# Altium schematic sheet 1166V30-3.SchDoc: Half-Bridge Phase 2
size A3; Author: M. Kutzsche; Organization: Kübrich Ing.-Gesellschaft; Address1: mbH & Co. KG; Address2: Weißmühle 10; Address3: D-96170 Priesendorf; DocumentNumber: UltraZohm; Revision: 30; SheetNumber: 3; SheetTotal: 5
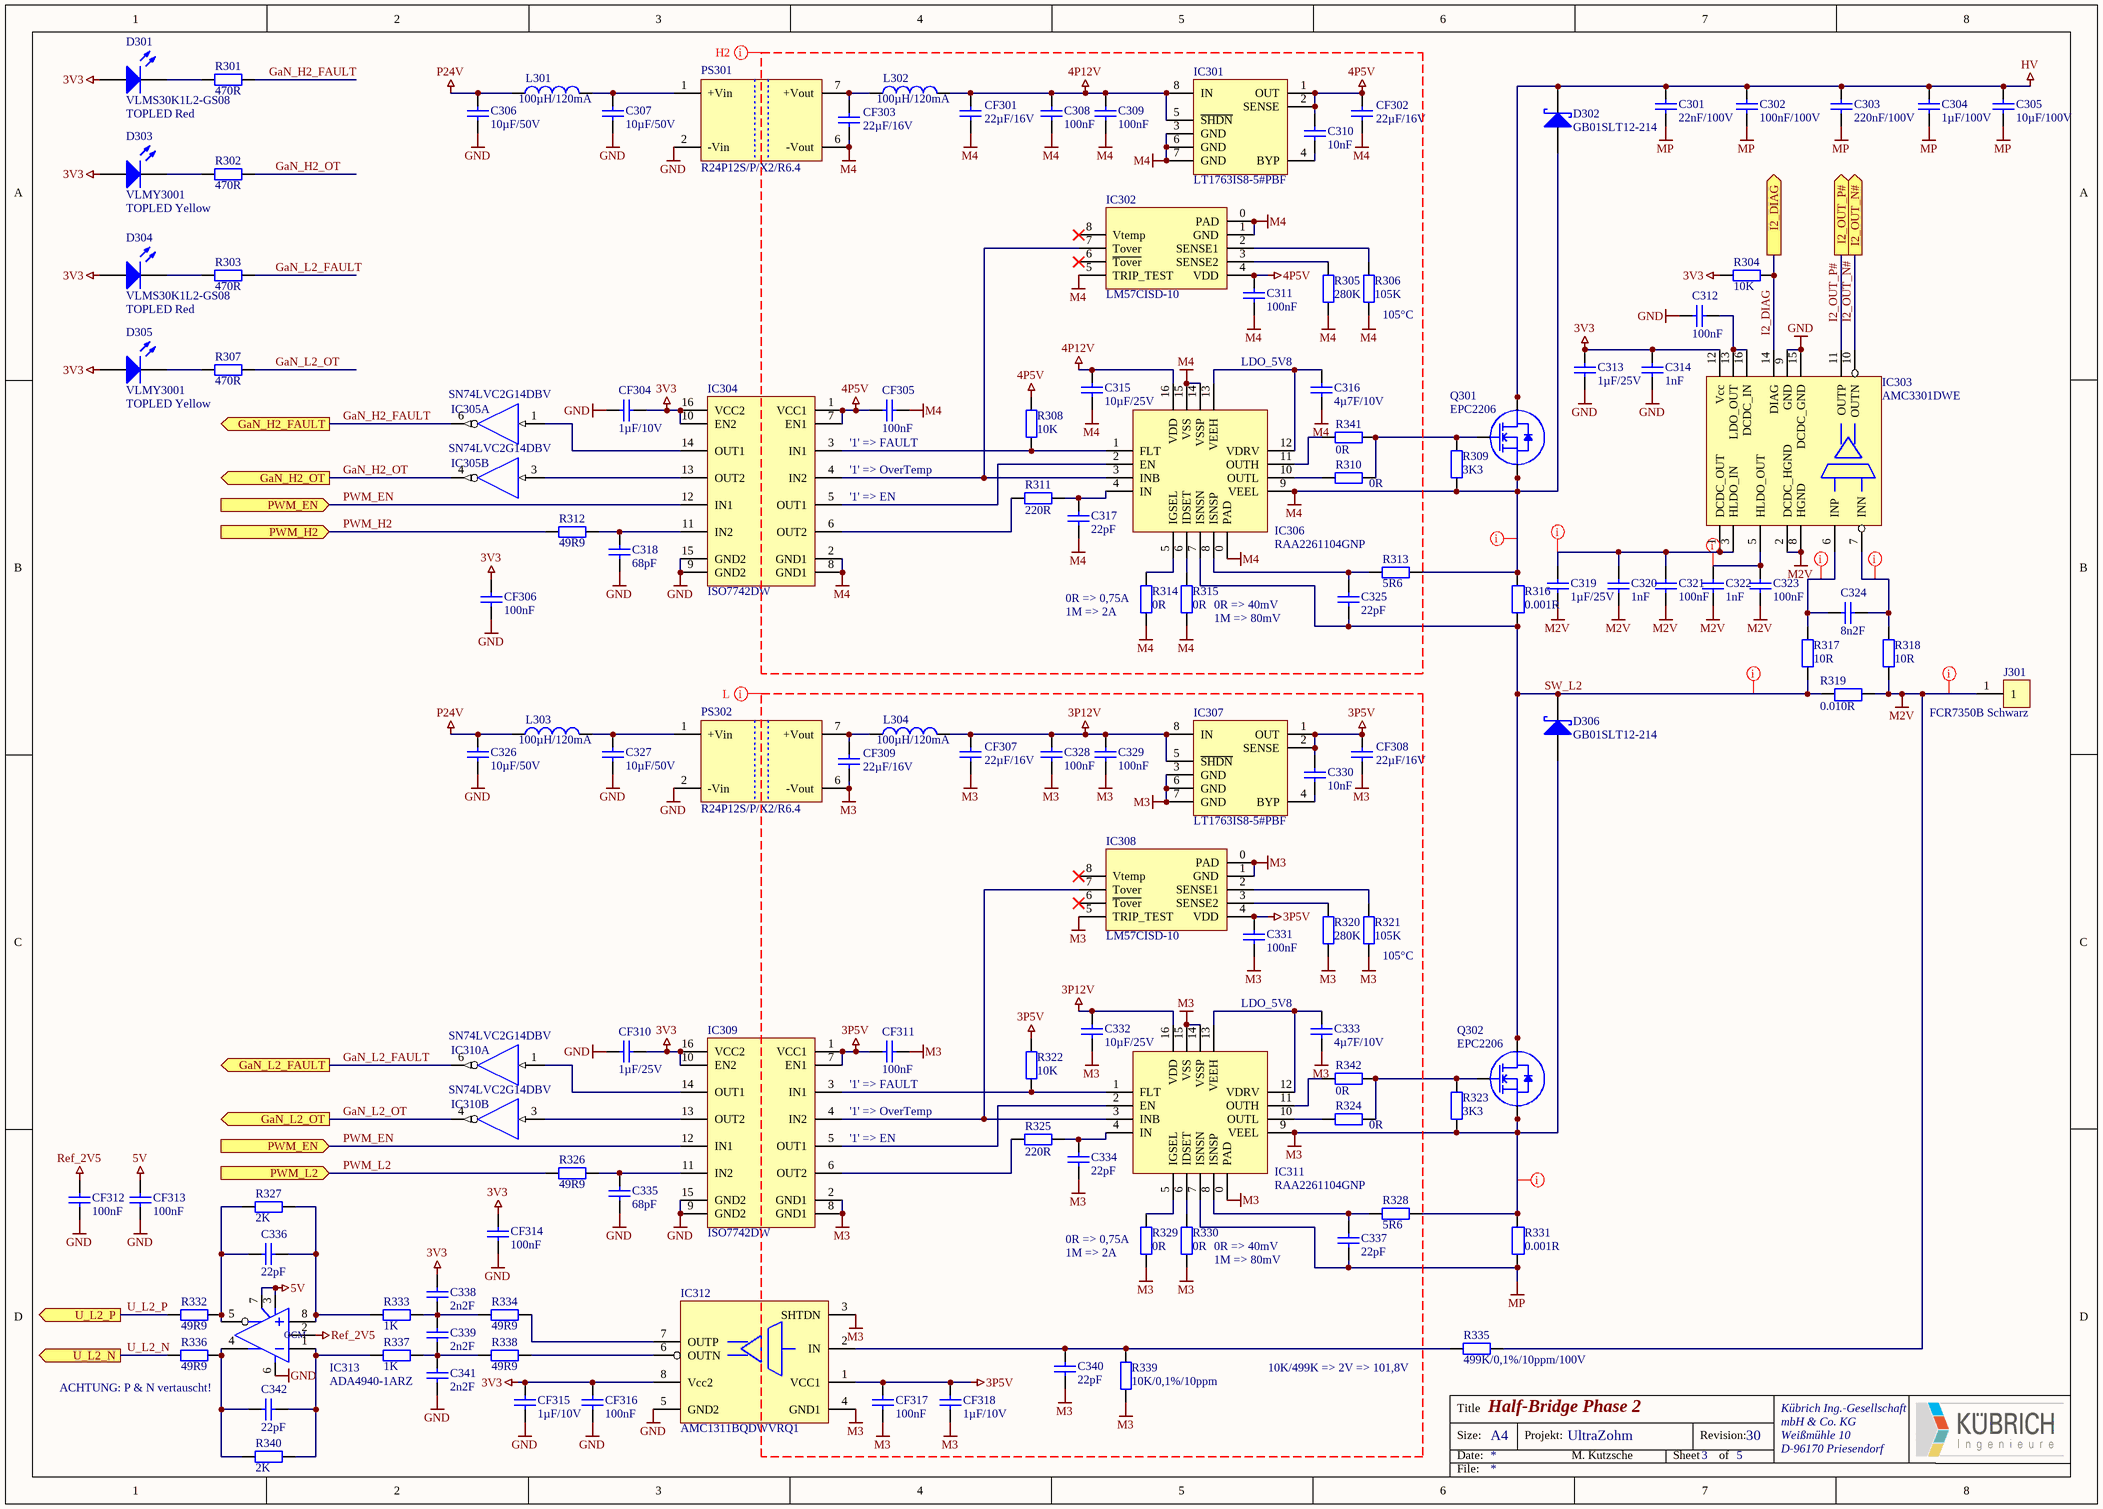
[diagram p0: 1166V30-3.SchDoc]

## Parts
C301  22nF/100V  [0805-Cap]
C302  100nF/100V  [0805-Cap]
C303  220nF/100V  [0805-Cap]
C304  1µF/100V  [0805-Cap]
C305  10µF/100V  [1210-Cap]
C306  10µF/50V  [1206-Cap]
C307  10µF/50V  [1206-Cap]
C308  100nF  [0603-Cap]
C309  100nF  [0603-Cap]
C310  10nF  [0603-Cap]
C311  100nF  [0603-Cap]
C312  100nF  [0603-Cap]
C313  1µF/25V  [1206-Cap]
C314  1nF  [1206-Cap]
C315  10µF/25V  [0805-Cap]
C316  4µ7F/10V  [0805-Cap]
C317  22pF  [0603-Cap]
C318  68pF  [0603-Cap]
C319  1µF/25V  [0603-Cap]
C320  1nF  [0603-Cap]
C321  100nF  [0603-Cap]
C322  1nF  [1206-Cap]
C323  100nF  [1206-Cap]
C324  8n2F  [0603-Cap]
C325  22pF  [0603-Cap]
C326  10µF/50V  [1206-Cap]
C327  10µF/50V  [1206-Cap]
C328  100nF  [0603-Cap]
C329  100nF  [0603-Cap]
C330  10nF  [0603-Cap]
C331  100nF  [0603-Cap]
C332  10µF/25V  [0805-Cap]
C333  4µ7F/10V  [0805-Cap]
C334  22pF  [0603-Cap]
C335  68pF  [0603-Cap]
C336  22pF  [0603-Cap]
C337  22pF  [0603-Cap]
C338  2n2F  [0603-Cap]
C339  2n2F  [0603-Cap]
C340  22pF  [0603-Cap]
C341  2n2F  [0603-Cap]
C342  22pF  [0603-Cap]
CF301  22µF/16V  [0805-Cap]
CF302  22µF/16V  [0805-Cap]
CF303  22µF/16V  [0805-Cap]
CF304  1µF/10V  [0603-Cap]
CF305  100nF  [0603-Cap]
CF306  100nF  [0603-Cap]
CF307  22µF/16V  [0805-Cap]
CF308  22µF/16V  [0805-Cap]
CF309  22µF/16V  [0805-Cap]
CF310  1µF/25V  [0603-Cap]
CF311  100nF  [0603-Cap]
CF312  100nF  [0603-Cap]
CF313  100nF  [0603-Cap]
CF314  100nF  [0603-Cap]
CF315  1µF/10V  [0603-Cap]
CF316  100nF  [0603-Cap]
CF317  100nF  [0603-Cap]
CF318  1µF/10V  [0603-Cap]
D301  VLMS30K1L2-GS08  Class II: TOPLED Red  [PLCC-2_rot]
D302  GB01SLT12-214  [DO-214 (SMB)]
D303  VLMY3001  Class II: TOPLED Yellow  [PLCC-2_gelb]
D304  VLMS30K1L2-GS08  Class II: TOPLED Red  [PLCC-2_rot]
D305  VLMY3001  Class II: TOPLED Yellow  [PLCC-2_gelb]
D306  GB01SLT12-214  [DO-214 (SMB)]
IC301  LT1763IS8-5#PBF  [SOIC-8-N]
IC302  LM57CISD-10  [WSON-8 (2.5x2.5mm)]
IC303  AMC3301DWE  [SOIC-16-W - 8.1mm]
IC304  ISO7742DW  [SOIC-16-W - 8.1mm]
IC305  SN74LVC2G14DBV  [SOT-23-6]  (parts A,B of 2)
IC306  RAA2261104GNP  [QFN-16 (4x4mm)]
IC307  LT1763IS8-5#PBF  [SOIC-8-N]
IC308  LM57CISD-10  [WSON-8 (2.5x2.5mm)]
IC309  ISO7742DW  [SOIC-16-W - 8.1mm]
IC310  SN74LVC2G14DBV  [SOT-23-6]  (parts A,B of 2)
IC311  RAA2261104GNP  [QFN-16 (4x4mm)]
IC312  AMC1311BQDWVRQ1  [SOIC-8-W]
IC313  ADA4940-1ARZ  [SOIC-8-N]
J301  FCR7350B Schwarz  [SLB4-I/90 - 4mm - Schwarz - CLIFF]
L301  100µH/120mA  [1007-IND (2518)]
L302  100µH/120mA  [1007-IND (2518)]
L303  100µH/120mA  [1007-IND (2518)]
L304  100µH/120mA  [1007-IND (2518)]
PS301  R24P12S/P/X2/R6.4  [SIP-7 Single - X2]
PS302  R24P12S/P/X2/R6.4  [SIP-7 Single - X2]
Q301  EPC2206  [D0232]
Q302  EPC2206  [D0232]
R301  470R  [0603-Res]
R302  470R  [0603-Res]
R303  470R  [0603-Res]
R304  10K  [0603-Res]
R305  280K  [0603-Res]
R306  105K  [0603-Res]
R307  470R  [0603-Res]
R308  10K  [0603-Res]
R309  3K3  [0603-Res]
R310  0R  [0603-Res]
R311  220R  [0603-Res]
R312  49R9  [0603-Res]
R313  5R6  [0603-Res]
R314  0R  [0603-Res]
R315  0R  [0603-Res]
R316  0.001R  [2512]
R317  10R  [0603-Res]
R318  10R  [0603-Res]
R319  0.010R  [GMR320]
R320  280K  [0603-Res]
R321  105K  [0603-Res]
R322  10K  [0603-Res]
R323  3K3  [0603-Res]
R324  0R  [0603-Res]
R325  220R  [0603-Res]
R326  49R9  [0603-Res]
R327  2K  [0603-Res]
R328  5R6  [0603-Res]
R329  0R  [0603-Res]
R330  0R  [0603-Res]
R331  0.001R  [2512]
R332  49R9  [0603-Res]
R333  1K  [0603-Res]
R334  49R9  [0603-Res]
R335  499K/0,1%/10ppm/100V  [0805-Res]
R336  49R9  [0603-Res]
R337  1K  [0603-Res]
R338  49R9  [0603-Res]
R339  10K/0,1%/10ppm  [0603-Res]
R340  2K  [0603-Res]
R341  0R  [0603-Res]
R342  0R  [0603-Res]

## Ports
GaN_H2_FAULT (out), GaN_H2_OT (out), GaN_L2_FAULT (out), GaN_L2_OT (out), I2_DIAG (out), I2_OUT_N# (out), I2_OUT_P# (out), PWM_EN (in), PWM_H2 (in), PWM_L2 (in), U_L2_N (out), U_L2_P (out)

## Nets
3P5V: C330.1 C331.1 CF308.1 CF311.2 CF317.1 CF318.1 IC307.1(OUT) IC307.2(SENSE) IC308.4(VDD) IC309.1(VCC1) IC309.7(EN1) IC312.1(VCC1) R322.1
3P12V: C328.1 C329.1 C332.2 CF307.1 IC307.5(~{SHDN}) IC307.8(IN) IC311.16(VDD) L304.2
3V3: C313.1 C314.1 C338.2 CF304.1 CF306.1 CF310.1 CF314.1 CF315.1 CF316.1 D301.1(A) D303.1(A) D304.1(A) D305.1(A) IC303.12(Vcc) IC304.10(EN2) IC304.16(VCC2) IC309.10(EN2) IC309.16(VCC2) IC312.8(Vcc2) R304.2
4P5V: C310.1 C311.1 CF302.1 CF305.2 IC301.1(OUT) IC301.2(SENSE) IC302.4(VDD) IC304.1(VCC1) IC304.7(EN1) R308.1
4P12V: C308.1 C309.1 C315.2 CF301.1 IC301.5(~{SHDN}) IC301.8(IN) IC306.16(VDD) L302.2
5V: CF313.1 IC313.3(V+) IC313.7(EN)
GND: C306.1 C307.1 C312.1 C313.2 C314.2 C318.1 C326.1 C327.1 C335.1 C341.1 CF304.2 CF306.2 CF310.2 CF312.2 CF313.2 CF314.2 CF315.2 CF316.2 IC303.9(GND) IC303.15(DCDC_GND) IC304.9(GND2) IC304.15(GND2) IC305.2(GND) IC309.9(GND2) IC309.15(GND2) IC310.2(GND) IC312.5(GND2) IC313.6(V-) PS301.2(-Vin) PS302.2(-Vin)
HV: C301.1 C302.1 C303.1 C304.1 C305.1 D302.2(K) Q301.3(D1) Q301.4(D2) Q301.7(D3) Q301.8(D4) Q301.11(D5) Q301.12(D6) Q301.15(D7) Q301.16(D8) Q301.19(D9) Q301.20(D10) Q301.23(D11) Q301.24(D12) Q301.27(D13) Q301.28(D14)
M2V: C319.2 C320.2 C321.2 C322.2 C323.2 IC303.2(DCDC_HGND) IC303.8(HGND) J301.1 R318.1 R319.1 R335.2
M3: C328.2 C329.2 C331.2 C332.1 C333.2 C334.1 C340.1 CF307.2 CF308.2 CF309.2 CF311.1 CF317.2 CF318.2 D306.1(A) IC307.3(GND) IC307.6(GND) IC307.7(GND) IC308.0(PAD) IC308.1(GND) IC308.5(TRIP_TEST) IC309.2(GND1) IC309.8(GND1) IC311.0(PAD) IC311.9(VEEL) IC311.14(VSSP) IC311.15(VSS) IC312.3(SHTDN) IC312.4(GND1) PS302.6(-Vout) Q302.2(S1) Q302.5(S2) Q302.6(S3) Q302.9(S4) Q302.10(S5) Q302.13(S6) Q302.14(S7) Q302.17(S8) Q302.18(S9) Q302.21(S10) Q302.22(S11) Q302.25(S12) Q302.26(S13) Q302.29(S14) Q302.30(Sub) R320.2 R321.2 R323.1 R328.2 R329.2 R330.2 R331.2 R339.2
M4: C308.2 C309.2 C311.2 C315.1 C316.2 C317.1 CF301.2 CF302.2 CF303.2 CF305.1 D302.1(A) IC301.3(GND) IC301.6(GND) IC301.7(GND) IC302.0(PAD) IC302.1(GND) IC302.5(TRIP_TEST) IC304.2(GND1) IC304.8(GND1) IC306.0(PAD) IC306.9(VEEL) IC306.14(VSSP) IC306.15(VSS) PS301.6(-Vout) Q301.2(S1) Q301.5(S2) Q301.6(S3) Q301.9(S4) Q301.10(S5) Q301.13(S6) Q301.14(S7) Q301.17(S8) Q301.18(S9) Q301.21(S10) Q301.22(S11) Q301.25(S12) Q301.26(S13) Q301.29(S14) Q301.30(Sub) R305.2 R306.2 R309.1 R313.2 R314.2 R315.2 R316.2
MP: C301.2 C302.2 C303.2 C304.2 C305.2 C337.1 IC311.7(ISNSN) R331.1
P24V: C306.2 C326.2 L301.1 L303.1
Ref_2V5: CF312.1 IC313.2(OCM)
VCC: IC305.5(VCC) IC310.5(VCC)
GaN_H2_FAULT: IC305.6(1Y) R301.2 ; port GaN_H2_FAULT
GaN_H2_OT: IC305.4(2Y) R302.2 ; port GaN_H2_OT
GaN_L2_FAULT: IC310.6(1Y) R303.2 ; port GaN_L2_FAULT
GaN_L2_OT: IC310.4(2Y) R307.2 ; port GaN_L2_OT
I2_DIAG: IC303.14(DIAG) R304.1 ; port I2_DIAG
I2_OUT_N#: IC303.10(OUTN) ; port I2_OUT_N#
I2_OUT_P#: IC303.11(OUTP) ; port I2_OUT_P#
PWM_EN: IC304.12(IN1) IC309.12(IN1) ; port PWM_EN
PWM_H2: R312.2 ; port PWM_H2
PWM_L2: R326.2 ; port PWM_L2
SW_L2: C325.1 D306.2(K) IC306.7(ISNSN) Q302.3(D1) Q302.4(D2) Q302.7(D3) Q302.8(D4) Q302.11(D5) Q302.12(D6) Q302.15(D7) Q302.16(D8) Q302.19(D9) Q302.20(D10) Q302.23(D11) Q302.24(D12) Q302.27(D13) Q302.28(D14) R316.1 R317.1 R319.2
U_L2_N: R336.2 ; port U_L2_N
U_L2_P: R332.2 ; port U_L2_P
NetC307_2: C307.2 L301.2 PS301.1(+Vin)
NetC310_2: C310.2 IC301.4(BYP)
NetC312_2: C312.2 IC303.13(LDO_OUT) IC303.16(DCDC_IN)
NetC316_1: C316.1 IC306.12(VDRV) IC306.13(VEEH)
NetC317_2: C317.2 IC306.4(IN) R311.1
NetC318_2: C318.2 IC304.11(IN2) R312.1
NetC319_1: C319.1 C320.1 C321.1 IC303.1(DCDC_OUT) IC303.3(HLDO_IN)
NetC322_1: C322.1 C323.1 IC303.5(HLDO_OUT)
NetC324_1: C324.1 IC303.7(INN) R318.2
NetC324_2: C324.2 IC303.6(INP) R317.2
NetC325_2: C325.2 IC306.8(ISNSP) R313.1
NetC327_2: C327.2 L303.2 PS302.1(+Vin)
NetC330_2: C330.2 IC307.4(BYP)
NetC333_1: C333.1 IC311.12(VDRV) IC311.13(VEEH)
NetC334_2: C334.2 IC311.4(IN) R325.1
NetC335_2: C335.2 IC309.11(IN2) R326.1
NetC336_1: C336.1 IC313.8(+) R327.1 R333.2
NetC336_2: C336.2 IC313.5(Out) R327.2 R332.1
NetC337_2: C337.2 IC311.8(ISNSP) R328.1
NetC338_1: C338.1 C339.2 R333.1 R334.2
NetC339_1: C339.1 C341.2 R337.1 R338.2
NetC340_2: C340.2 IC312.2(IN) R335.1 R339.1
NetC342_1: C342.1 IC313.1(-) R337.2 R340.1
NetC342_2: C342.2 IC313.4(Out) R336.1 R340.2
NetCF303_1: CF303.1 L302.1 PS301.7(+Vout)
NetCF309_1: CF309.1 L304.1 PS302.7(+Vout)
NetD301_2: D301.2(K) R301.1
NetD303_2: D303.2(K) R302.1
NetD304_2: D304.2(K) R303.1
NetD305_2: D305.2(K) R307.1
NetIC302_2: IC302.2(SENSE1) R306.1
NetIC302_3: IC302.3(SENSE2) R305.1
NetIC302_7: IC302.7(Tover) IC304.4(IN2) IC306.3(INB)
NetIC304_3: IC304.3(IN1) IC306.1(FLT) R308.2
NetIC304_5: IC304.5(OUT1) IC306.2(EN)
NetIC304_6: IC304.6(OUT2) R311.2
NetIC304_13: IC304.13(OUT2) IC305.3(2A)
NetIC304_14: IC304.14(OUT1) IC305.1(1A)
NetIC306_5: IC306.5(IGSEL) R314.1
NetIC306_6: IC306.6(IDSET) R315.1
NetIC306_10: IC306.10(OUTL) R310.1
NetIC306_11: IC306.11(OUTH) R341.1
NetIC308_2: IC308.2(SENSE1) R321.1
NetIC308_3: IC308.3(SENSE2) R320.1
NetIC308_7: IC308.7(Tover) IC309.4(IN2) IC311.3(INB)
NetIC309_3: IC309.3(IN1) IC311.1(FLT) R322.2
NetIC309_5: IC309.5(OUT1) IC311.2(EN)
NetIC309_6: IC309.6(OUT2) R325.2
NetIC309_13: IC309.13(OUT2) IC310.3(2A)
NetIC309_14: IC309.14(OUT1) IC310.1(1A)
NetIC311_5: IC311.5(IGSEL) R329.1
NetIC311_6: IC311.6(IDSET) R330.1
NetIC311_10: IC311.10(OUTL) R324.1
NetIC311_11: IC311.11(OUTH) R342.1
NetIC312_6: IC312.6(OUTN) R338.1
NetIC312_7: IC312.7(OUTP) R334.1
NetQ301_1: Q301.1(G) R309.2 R310.2 R341.2
NetQ302_1: Q302.1(G) R323.2 R324.2 R342.2

Not connected (* = marked no-connect by the designer): IC302 6(~{Tover})* 8(Vtemp)*; IC308 6(~{Tover})* 8(Vtemp)*

## Layout directives
net class H2: 4P5V, 4P12V, M2V, M4, NetC319_1, NetC322_1, NetC324_1, NetC324_2, SW_L2
net class L: 3P5V, 3P12V, M3

## Notes on the sheet
- (near R306) 105°C
- LDO_5V8
- '1' => FAULT
- '1' => OverTemp
- (near IC304) '1' => EN
- (near R314) 1M => 2A
- (near R314) 0R => 0,75A
- (near R315) 0R => 40mV
- (near R315) 1M => 80mV
- (near R321) 105°C
- (near IC309) '1' => EN
- (near R329) 1M => 2A
- (near R329) 0R => 0,75A
- (near R330) 0R => 40mV
- (near R330) 1M => 80mV
- ACHTUNG: P & N vertauscht!
- (near R335) 10K/499K => 2V => 101,8V
- Title
- Size:
- Date:
- A4
- Projekt:
- Sheet
- Revision:
- of
- File:

## Library data of the parts
C301-C342 CF301-CF318 = Cap_SMD: Capacitor (SMD); Class I: Pasiv; Class II: Capacitor; Last edited: 20.11.2006 10:25
  C301: value: 22nF/100V
  C302: value: 100nF/100V
  C303: value: 220nF/100V
  C304: value: 1µF/100V
  C305: value: 10µF/100V
  C306 C307 C326 C327: value: 10µF/50V
  C308 C309 C311 C312 C321 C323 C328 C329 C331 CF305 CF306 CF311-CF314 CF316 CF317: value: 100nF
  C310 C330: value: 10nF
  C313 C319 CF310: value: 1µF/25V
  C314 C320 C322: value: 1nF
  C315 C332: value: 10µF/25V
  C316 C333: value: 4µ7F/10V
  C317 C325 C334 C336 C337 C340 C342: value: 22pF
  C318 C335: value: 68pF
  C324: value: 8n2F
  C338 C339 C341: value: 2n2F
  CF301-CF303 CF307-CF309: value: 22µF/16V
  CF304 CF315 CF318: value: 1µF/10V
D301 D304 = VLMS30K1L2-GS08: Top LED Super red, 2mA, 18mcd, -40-100°C; Manufacturer: Vishay; Class I: Discrete; Best.-Nr.: Farnell 132-8349; Last edited: 23.01.2007 08:58
D302 D306 = GB01SLT12-214: Silicon Carbide Schottky Diode Vr=1200V If=1A; Manufacturer: GeneSiC Semiconductor; Class I: Discret; Package information: Unknown; Best.-Nr.: DigiKey: 1242-1169-1-ND; Class II: Silicon Carbide Schottky Diode Vr=1200V If=1A; Datasheet: Ver. 7 Nov 2000; Package reference: DO-214AA (SMB)
D303 D305 = VLMY3001: Top LED Yellow, 2mA, 18mcd, -40-100°C; Manufacturer: Vishay; Class I: Discrete; Best.-Nr.: ???; Last edited: 23.01.2007 08:58
IC301 IC307 = LT1763IS8-5#PBF: LDO 5V/500mA, Vin 20V (-40-125°C); Manufacturer: Linear Technology; Class I: Discret; Package information: Unknown; Best.-Nr.: Farnell 229-5214; Class II: LDO 5V/500mA, Vin 20V (-40-125°C); Datasheet: ???; Package reference: SO-8
IC302 IC308 = LM57CISD-10: Temperature Sensor/Switch -40 - 150°C, Resistor-Programmable, 10°C Hysterese; Manufacturer: Texas Instruments; Class I: Sensor; Best.-Nr.: DigiKey: LM57CISD-10/NOPBCT-ND; Class II: Temperature Sensor/Switch -40 - 150°C, Resistor-Programmable, 10°C Hysterese
IC303 = AMC3301DWE: ±250 mV Input Voltage Range, Reinforced Isolated Amplifier and High Bandwidth of 300 kHz; Manufacturer: Texas Instruments; Class II: ±250 mV, 300KHz, -40-125°C; Package information: Unknown; Best.-Nr.: DigiKey: 296-AMC3301DWE-ND; Class I: Isolated Amplifier; Datasheet: Unknown; Package reference: SOIC-16-W
IC304 IC309 = ISO7742DW: Quad-CH 100Mbps Isolators 2 IN/2 OUT, 5000V Reinforced, (-40-125°C); Manufacturer: Texas Instruments; Class I: Optocoupler; Package information: Unknown; Best.-Nr.: DigiKey: 296-44609-1-ND; Class II: Quad-CH 100Mbps Isolators 2 IN/2 OUT, 5000V Reinforced, (-40-125°C); Datasheet: Unknown; Package reference: SOIC-16W
IC305 IC310 = SN74LVC2G14D_: Dual Inverter with Schmitt Trigger Input; Manufacturer: Texas Instrument; Class I: Logic; value121: SN74LVC2G14DCK; Datasheet: SCES200J; Class II: Dual Inverter with Schmitt Trigger Input; value111: SN74LVC2G14DBV; Last edited: 22.01.2007 11:08
IC306 IC311 = RAA2261104GNP: Low -Side GaN FET-Driver, 6,5V - 18V; Manufacturer: Renesas; Class I: Discret; Package information: Unknown; Best.-Nr.: Mouser: 968-2261104GNP#AA0; Class II: Low -Side GaN FET-Driver, 6,5V - 18V; Datasheet: Rev. Mar 2002; Package reference: QFN-16
IC312 = AMC1311BQDWVRQ1: 2V Input, Automotive High-Impedance, Reinforced Isolated Amplifier for Voltage Sensing; Manufacturer: Texas Instruments; Class II: 2V, 275KHz, -40-125°C; Package information: Unknown; Best.-Nr.: Mouser: 595-AMC1311BQDWVRQ1; Class I: Isolated Amplifier; Datasheet: Unknown; Package reference: SOIC-8-W
IC313 = ADA4940-1ARZ: Fully Differential ADC Drivers (-40-125°C); Manufacturer: ANALOG DEVICES; Class I: Analog; Best.-Nr.: Farnell 209-6178; Class II: Fully Differential ADC Drivers (-40-125°C); Datasheet: DSO11449, Ver. Aug 2000; Last edited: 04.01.2007 10:14; Package Reference: SOIC-N-8
J301 = FCR7350B Schwarz: Labor Winkelbuchsen 4mm Schwarz; Manufacturer: CLIFF Electronic; Class I: Connectors; Best.-Nr.: Farnell: 185-4507; Class II: Labor Winkelbuchsen 4mm Schwarz; Last edited: 07.03.2007 13:28
L301-L304 = CB2518T101K: 100µH, 60/120mA. (1007), -40-105°C; Manufacturer: Taiyo Yuden; Class I: Pasive; Best.-Nr.: DigiKey:   587-2192-1-ND; Class II: 100µH, 60/120mA. (1007), -40-105°C; Last edited: 08.12.2006 12:28
PS301 PS302 = R24P12S/P/X2/R6.4: DC/DC Converter 24V to 12V, 1W, 84mA (unregulated) 6,4KVDC Rainforced; Manufacturer: Recom; Class I: Analog; Package information: Unknown; Best.-Nr.: Mouser: 919-R24P12SX2PR6.4; Class II: DC/DC Converter 24V to 12V, 1W, 84mA (unregulated) 6,4KVDC Rainforced; Package reference: SIP-7; Datasheet: Rev. 28 Apr 2002
Q301 Q302 = EPC2206: GaN-Fet 80V, 2.2mOhm, 90A; Manufacturer: EPC; Class I: Discret; Package information: Unknown; Best.-Nr.: DigiKey: 917-1212-1-ND; Class II: GaN-Fet 80V, 2.2mOhm, 90A; Datasheet: Rev. Mar 2002; Package reference: DIE
R301-R315 R317 R318 R320-R330 R332-R342 = Res_SMD: Resistor SMD; Class I: Pasiv; Class II: Resistor; Last edited: 17.11.2006 11:38
  R301-R303 R307: value: 470R
  R304 R308 R322: value: 10K
  R305 R320: value: 280K
  R306 R321: value: 105K
  R309 R323: value: 3K3
  R310 R314 R315 R324 R329 R330 R341 R342: value: 0R
  R311 R325: value: 220R
  R312 R326 R332 R334 R336 R338: value: 49R9
  R313 R328: value: 5R6
  R317 R318: value: 10R
  R327 R340: value: 2K
  R333 R337: value: 1K
  R335: value: 499K/0,1%/10ppm/100V
  R339: value: 10K/0,1%/10ppm
R316 R331 = CSS2H-2512R-1L00F: Shunt 0.001R, 5W, 1%, 50ppm/°C; Manufacturer: Bourns; Class I: Pasiv; Class II: Shunt 5W; Best.-Nr.: Farnell 257-6347; Last edited: 23.11.2010 14:12; value: 0.001R
R319 = GMR320HJBFA10L0: Shunt 0.010R, 10W, 1%, 25ppm; Manufacturer: ROHM; Class I: Pasiv; Class II: Shunt 10W; Best.-Nr.: DigiKey 511-GMR320HJBFA10L0CT-ND; Mouser: 755-GMR320HJBFA10L0; Last edited: 23.11.2006 14:12; value: 0.010R